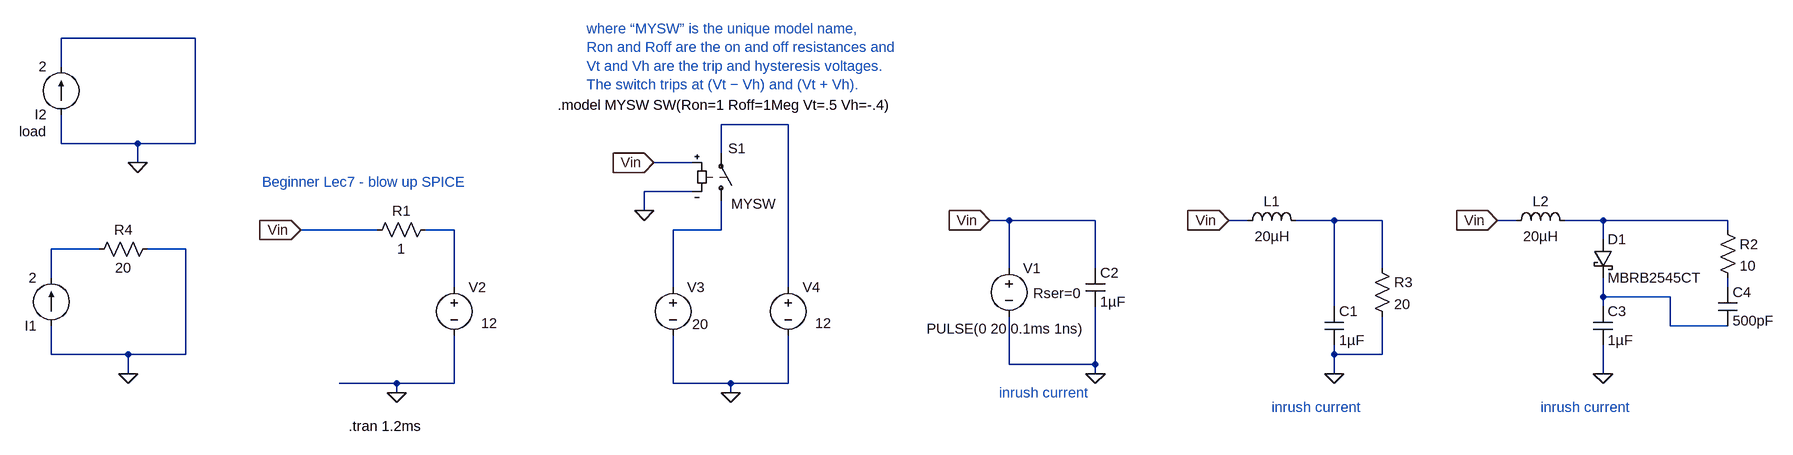
[diagram p0: schematic LTspice 02-5 blow up.asc]
LTspice 02-5 blow up.asc, the LTspice schematic file:
Version 4
SHEET 1 2928 900
WIRE -96 -128 -320 -128
WIRE -320 -80 -320 -128
WIRE 1232 16 1120 16
WIRE -320 48 -320 0
WIRE -192 48 -320 48
WIRE -96 48 -96 -128
WIRE -96 48 -192 48
WIRE 1120 64 1120 16
WIRE -192 80 -192 48
WIRE 1072 80 1008 80
WIRE 1072 128 992 128
WIRE 992 160 992 128
WIRE 1600 176 1568 176
WIRE 1744 176 1600 176
WIRE 2048 176 2016 176
WIRE 2192 176 2128 176
WIRE 2272 176 2192 176
WIRE 2496 176 2464 176
WIRE 2640 176 2576 176
WIRE 2848 176 2640 176
WIRE 464 192 336 192
WIRE 592 192 544 192
WIRE 1120 192 1120 144
WIRE 1120 192 1040 192
WIRE 2848 192 2848 176
WIRE 2640 208 2640 176
WIRE -256 224 -336 224
WIRE -112 224 -176 224
WIRE 1600 256 1600 176
WIRE 1744 256 1744 176
WIRE 2272 256 2272 176
WIRE -336 272 -336 224
WIRE 592 288 592 192
WIRE 1040 288 1040 192
WIRE 1232 288 1232 16
WIRE 2848 288 2848 272
WIRE 2640 304 2640 272
WIRE 2752 304 2640 304
WIRE 2192 320 2192 176
WIRE 2640 320 2640 304
WIRE 2752 352 2752 304
WIRE 2848 352 2752 352
WIRE -336 400 -336 352
WIRE -208 400 -336 400
WIRE -112 400 -112 224
WIRE -112 400 -208 400
WIRE 2192 400 2192 384
WIRE 2272 400 2272 336
WIRE 2272 400 2192 400
WIRE 1600 416 1600 336
WIRE 1744 416 1744 320
WIRE 1744 416 1600 416
WIRE -208 432 -208 400
WIRE 1744 432 1744 416
WIRE 2192 432 2192 400
WIRE 2640 432 2640 384
WIRE 496 448 400 448
WIRE 592 448 592 368
WIRE 592 448 496 448
WIRE 1040 448 1040 368
WIRE 1136 448 1040 448
WIRE 1232 448 1232 368
WIRE 1232 448 1136 448
WIRE 496 464 496 448
WIRE 1136 464 1136 448
FLAG 496 464 0
FLAG 336 192 Vin
IOPIN 336 192 In
FLAG 1744 432 0
FLAG 1568 176 Vin
IOPIN 1568 176 In
FLAG 1136 464 0
FLAG 1008 80 Vin
IOPIN 1008 80 In
FLAG 992 160 0
FLAG 2192 432 0
FLAG 2016 176 Vin
IOPIN 2016 176 In
FLAG 2640 432 0
FLAG 2464 176 Vin
IOPIN 2464 176 In
FLAG -208 432 0
FLAG -192 80 0
SYMBOL voltage 1600 240 R0
WINDOW 123 0 0 Left 2
WINDOW 39 40 58 Left 2
WINDOW 3 -137 117 Left 2
SYMATTR SpiceLine Rser=0
SYMATTR Value PULSE(0 20 0.1ms 1ns)
SYMATTR InstName V1
SYMBOL cap 1728 256 R0
SYMATTR InstName C2
SYMATTR Value 1µF
SYMBOL voltage 592 272 R0
WINDOW 123 0 0 Left 2
WINDOW 39 0 0 Left 2
WINDOW 3 45 76 Left 2
SYMATTR Value 12
SYMATTR InstName V2
SYMBOL sw 1120 160 M180
WINDOW 0 12 104 Left 2
WINDOW 3 17 11 Left 2
SYMATTR InstName S1
SYMATTR Value MYSW
SYMBOL voltage 1040 272 R0
WINDOW 123 0 0 Left 2
WINDOW 39 24 44 Left 2
WINDOW 3 32 78 Left 2
SYMATTR Value 20
SYMATTR InstName V3
SYMBOL voltage 1232 272 R0
WINDOW 123 0 0 Left 2
WINDOW 39 0 0 Left 2
WINDOW 3 45 76 Left 2
SYMATTR Value 12
SYMATTR InstName V4
SYMBOL res 560 176 R90
WINDOW 0 0 56 VBottom 2
WINDOW 3 32 56 VTop 2
SYMATTR InstName R1
SYMATTR Value 1
SYMBOL cap 2176 320 R0
SYMATTR InstName C1
SYMATTR Value 1µF
SYMBOL ind 2032 192 R270
WINDOW 0 32 56 VTop 2
WINDOW 3 5 56 VBottom 2
SYMATTR InstName L1
SYMATTR Value 20µH
SYMBOL cap 2624 320 R0
SYMATTR InstName C3
SYMATTR Value 1µF
SYMBOL ind 2480 192 R270
WINDOW 0 32 56 VTop 2
WINDOW 3 5 56 VBottom 2
SYMATTR InstName L2
SYMATTR Value 20µH
SYMBOL schottky 2624 208 R0
SYMATTR InstName D1
SYMATTR Value MBRB2545CT
SYMATTR Description Diode
SYMATTR Type diode
SYMBOL res 2832 176 R0
SYMATTR InstName R2
SYMATTR Value 10
SYMBOL cap 2832 288 R0
SYMATTR InstName C4
SYMATTR Value 500pF
SYMBOL res 2256 240 R0
SYMATTR InstName R3
SYMATTR Value 20
SYMBOL current -336 352 R180
WINDOW 123 0 0 Left 2
WINDOW 39 0 0 Left 2
SYMATTR InstName I1
SYMATTR Value 2
SYMBOL res -160 208 R90
WINDOW 0 0 56 VBottom 2
WINDOW 3 32 56 VTop 2
SYMATTR InstName R4
SYMATTR Value 20
SYMBOL current -320 0 R180
WINDOW 123 0 0 Left 2
WINDOW 39 24 -28 Left 2
SYMATTR SpiceLine load
SYMATTR InstName I2
SYMATTR Value 2
TEXT 416 520 Left 2 !.tran 1.2ms
TEXT 272 112 Left 2 ;Beginner Lec7 - blow up SPICE
TEXT 848 -16 Left 2 !.model MYSW SW(Ron=1 Roff=1Meg Vt=.5 Vh=-.4)
TEXT 896 -144 Left 2 ;where “MYSW” is the unique model name, \nRon and Roff are the on and off resistances and \nVt and Vh are the trip and hysteresis voltages. \nThe switch trips at (Vt − Vh) and (Vt + Vh).
TEXT 1584 464 Left 2 ;inrush current
TEXT 2088 488 Left 2 ;inrush current
TEXT 2536 488 Left 2 ;inrush current

The netlist it stands for:
* LTspice 02-5 blow up.asc
V1 Vin 0 PULSE(0 20 0.1ms 1ns) Rser=0
C2 Vin 0 1µF
V2 N004 0 12
S1 N005 N001 Vin 0 MYSW
V3 N005 0 20
V4 N001 0 12
R1 N004 Vin 1
C1 N002 0 1µF
L1 Vin N002 20µH
C3 N008 0 1µF
L2 Vin N003 20µH
D1 N003 N008 MBRB2545CT
R2 N003 N007 10
C4 N007 N008 500pF
R3 N002 0 20
I1 0 N006 2
R4 0 N006 20
I2 0 0 2 load
.model D D
.lib standard.dio
.tran 1.2ms
* Beginner Lec7 - blow up SPICE
.model MYSW SW(Ron=1 Roff=1Meg Vt=.5 Vh=-.4)
* where “MYSW” is the unique model name,
* Ron and Roff are the on and off resistances and
* Vt and Vh are the trip and hysteresis voltages.
* The switch trips at (Vt − Vh) and (Vt + Vh).
* inrush current
* inrush current
* inrush current
.backanno
.end